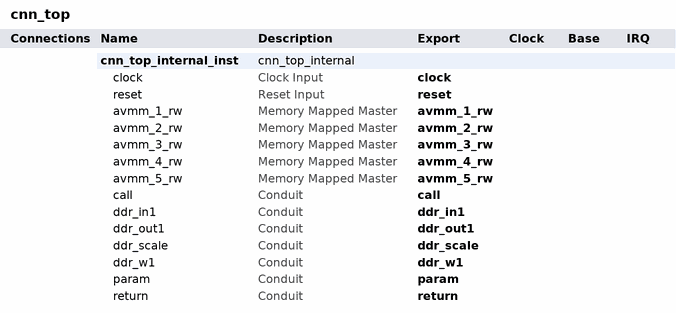
[diagram p0: system contents]
# Platform Designer (Qsys) system cnn_top, Cyclone V 5CGXFC7C7F23C8
# Parameters at their usual value, and those the tool derives, are not listed.
package require qsys
create_system cnn_top
set_project_property DEVICE_FAMILY {Cyclone V}
set_project_property DEVICE 5CGXFC7C7F23C8

add_instance cnn_top_internal_inst cnn_top_internal 1.0
set_instance_property cnn_top_internal_inst AUTO_EXPORT true

# exported interfaces
add_interface avmm_1_rw avalon master
set_interface_property avmm_1_rw EXPORT_OF cnn_top_internal_inst.avmm_1_rw
add_interface avmm_2_rw avalon master
set_interface_property avmm_2_rw EXPORT_OF cnn_top_internal_inst.avmm_2_rw
add_interface avmm_3_rw avalon master
set_interface_property avmm_3_rw EXPORT_OF cnn_top_internal_inst.avmm_3_rw
add_interface avmm_4_rw avalon master
set_interface_property avmm_4_rw EXPORT_OF cnn_top_internal_inst.avmm_4_rw
add_interface avmm_5_rw avalon master
set_interface_property avmm_5_rw EXPORT_OF cnn_top_internal_inst.avmm_5_rw
add_interface call conduit end
set_interface_property call EXPORT_OF cnn_top_internal_inst.call
add_interface clock clock sink
set_interface_property clock EXPORT_OF cnn_top_internal_inst.clock
add_interface ddr_in1 conduit end
set_interface_property ddr_in1 EXPORT_OF cnn_top_internal_inst.ddr_in1
add_interface ddr_out1 conduit end
set_interface_property ddr_out1 EXPORT_OF cnn_top_internal_inst.ddr_out1
add_interface ddr_scale conduit end
set_interface_property ddr_scale EXPORT_OF cnn_top_internal_inst.ddr_scale
add_interface ddr_w1 conduit end
set_interface_property ddr_w1 EXPORT_OF cnn_top_internal_inst.ddr_w1
add_interface param conduit end
set_interface_property param EXPORT_OF cnn_top_internal_inst.param
add_interface reset reset sink
set_interface_property reset EXPORT_OF cnn_top_internal_inst.reset
add_interface return conduit end
set_interface_property return EXPORT_OF cnn_top_internal_inst.return

set_interconnect_requirement {$system} qsys_mm.clockCrossingAdapter HANDSHAKE
set_interconnect_requirement {$system} qsys_mm.enableEccProtection FALSE
set_interconnect_requirement {$system} qsys_mm.insertDefaultSlave FALSE
set_interconnect_requirement {$system} qsys_mm.maxAdditionalLatency 1

save_system cnn_top.qsys
